# EAGLE design db9nes (EAGLE 9.0.0)
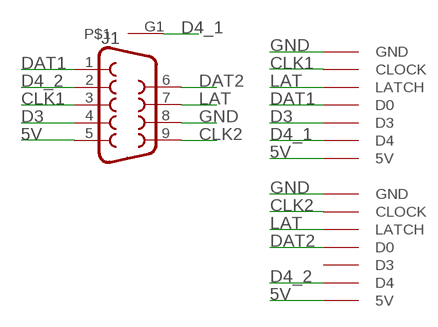
[diagram p0: schematic, sheet 1]

## Parts
J1  DB9FEMALE  [DB9]
U$1  NESCONNNO_TABS  [NESCONN_NO_TABS]
U$2  NESCONNNO_TABS  [NESCONN_NO_TABS]

## Nets
5V: J1.5 U$1.5V U$2.5V
CLK1: J1.3 U$2.CLOCK
CLK2: J1.9 U$1.CLOCK
D3: J1.4 U$2.D3
D4_1: J1.G1 U$2.D4
D4_2: J1.2 U$1.D4
DAT1: J1.1 U$2.D0
DAT2: J1.6 U$1.D0
GND: J1.8 U$1.GND U$2.GND
LAT: J1.7 U$1.LATCH U$2.LATCH
Unconnected: U$1.D3

## Library data of the parts
J1 = SparkFun-Connectors:DB9: DB9 Connector Standard DB9 (D-Sub 9) serial connector. Can be used for CAN bus as well as RS485 and RS232. Footprint production proven. Here is the female version connector we sell at SparkFun: 9 Pin Female Serial Connector - PCB Mount <https://www.sparkfun.com/products/429> (PRT-00429) This connector has been used on the following SparkFun products: SparkFun RS232 Shifter - SMD <https://www.sparkfun.com/products/449> (PRT-00449) SparkFun RS232 Shifter SMD (No DB9) <https://www.sparkfun.com/products/8780> (PRT-08780); PROD_ID: CONN-08194
U$1 U$2 = gamepad-conn:NESCONN

## Board
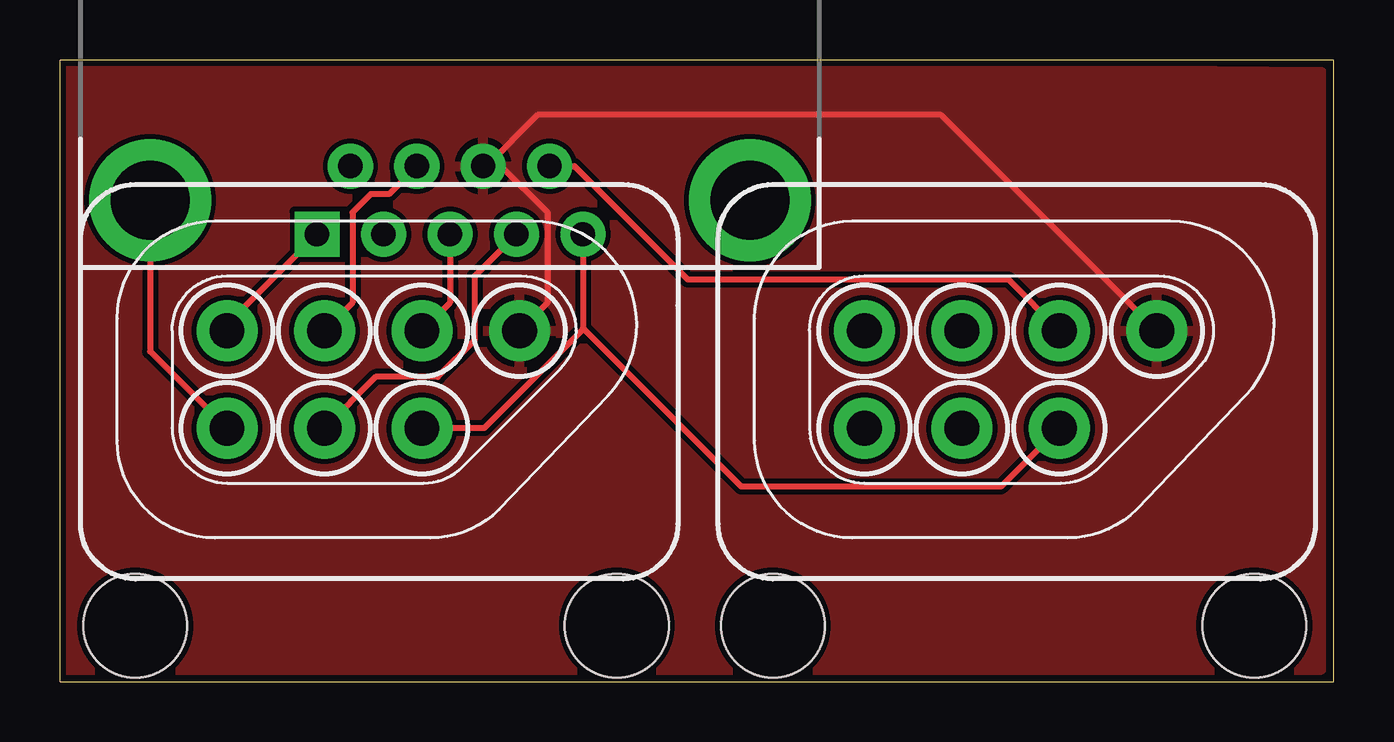
[diagram p1: board, top side]
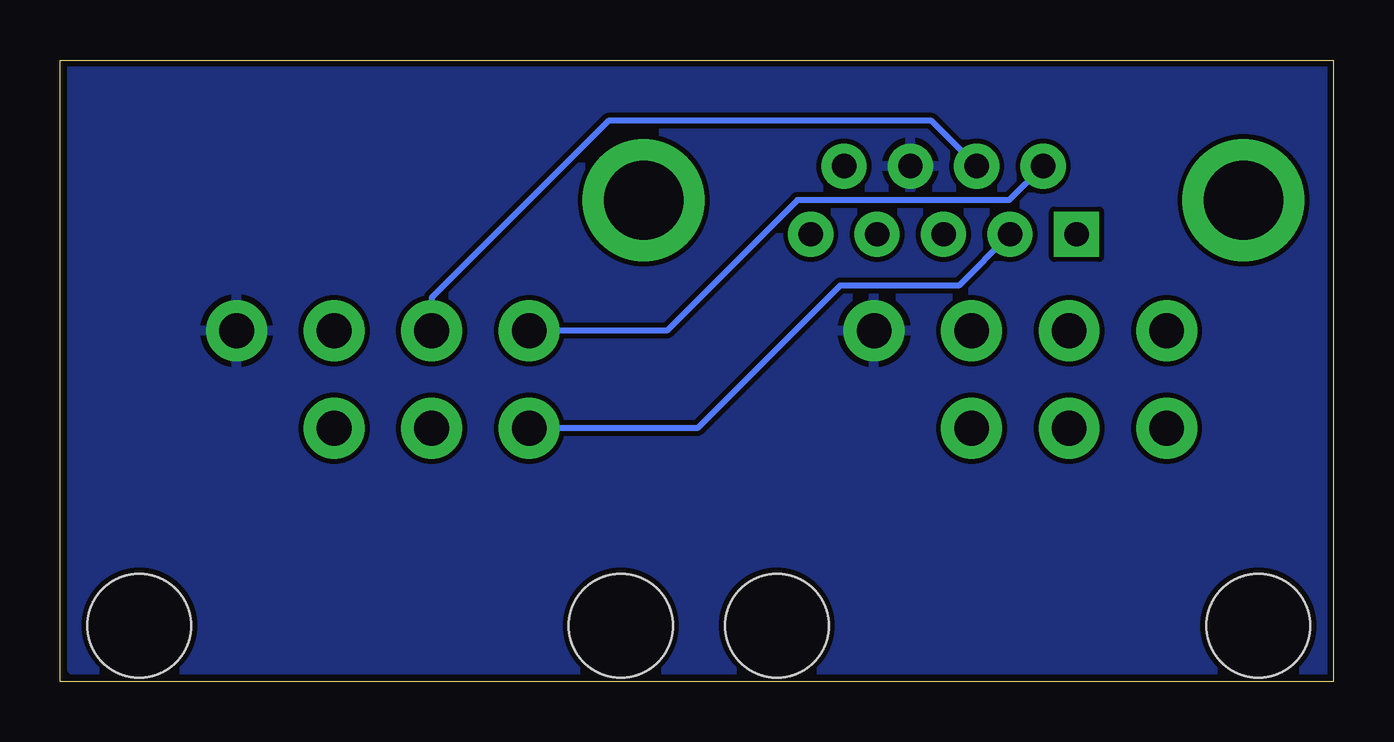
[diagram p2: board, bottom side, seen from below]

Size 53.09 x 25.91 mm. Coordinates in mm from the lower left corner, seen from the top.
Outline: 53.09,25.91 0,25.91 0,0 53.09,0 53.09,25.91
Copper layers (1*16): Top 0.035mm / dielectric 1.5mm / Bottom 0.035mm
Design rules "default *": minimum track width 10mil, minimum drill 24mil, track to track 8mil, track to pad 8mil, pad to pad 8mil, via to via 8mil, smd to smd 8mil, copper to edge 10mil, drill to drill 8mil, minimum pad ring 10mil, minimum via ring 8mil, stop-mask expansion 4mil, vias tented up to drill 0mil, thermal gap 10mil
Holes 4.32 mm at 23.21,2.34 3.14,2.33 49.78,2.34 29.71,2.33

### Footprints (pad centres in the part's own frame; a part is rotated, then mirrored left to right if it is on the bottom)
DB9 = drill 1.016 pad 1.88 square: 1 -5.54,-1.42 | drill 1.016 pad 1.88: 2 -2.77,-1.42; 3 0,-1.42; 4 2.77,-1.42; 5 5.54,-1.42; 6 -4.15,1.42; 7 -1.38,1.42; 8 1.38,1.42; 9 4.15,1.42 | drill 3.302 pad 5.08: G1 -12.5,0; G2 12.5,0
NESCONN_NO_TABS = drill 1.448 pad 2.54: 5V 8.128,0; CLOCK 8.128,4.064; D0 0,4.064; D3 4.064,0; D4 0,0; GND 12.192,4.064; LATCH 4.064,4.064

### Placement (x,y rotation side)
J1  16.26,20.07 0 top
U$1  33.53,10.57 0 top
U$2  6.96,10.57 0 top

### Tracks (layer width: path | path; a pad name or v marks a point on that pad's centre or on a via)
5V
  Top 0.254: J1.5 21.8,14.73 | 21.8,14.73 21.8,14.68 17.68,10.57 U$2.5V | U$1.5V 39.22,8.13 28.4,8.13 21.8,14.73
CLK1
  Top 0.254: J1.3 16.26,15.8 U$2.CLOCK
CLK2
  Top 0.254: J1.9 21.44,21.49 26.16,16.76 39.52,16.76 U$1.CLOCK
D3
  Top 0.254: J1.4 17.27,16.89 17.27,14.22 15.75,12.7 13.16,12.7 U$2.D3
D4_1
  Top 0.254: J1.G1 3.76,13.77 U$2.D4
D4_2
  Bottom 0.254: J1.2 15.62,16.51 20.57,16.51 26.52,10.57 U$1.D4
DAT1
  Top 0.254: J1.1 6.96,14.89 U$2.D0
DAT2
  Bottom 0.254: J1.6 13.53,20.07 22.35,20.07 27.79,14.63 U$1.D0
GND
  Top 0.254: J1.8 17.78,21.49 | 17.78,21.49 18.39,21.49 20.32,19.56 20.32,15.8 U$2.GND | U$1.GND 36.73,23.62 19.92,23.62 17.78,21.49
  pour Top: 52.58,25.4 0.25,25.91 0.25,0.51 52.58,0.51
  pour Bottom: 52.58,25.65 0.25,25.91 0.25,0.51 52.58,0.51
LAT
  Top 0.254: J1.7 13.71,20.32 12.95,20.32 12.19,19.56 12.19,15.8 U$2.LATCH
  Bottom 0.254: J1.7 16.76,23.37 30.23,23.37 37.59,16 U$1.LATCH